# EAGLE design drive (EAGLE 5.12)
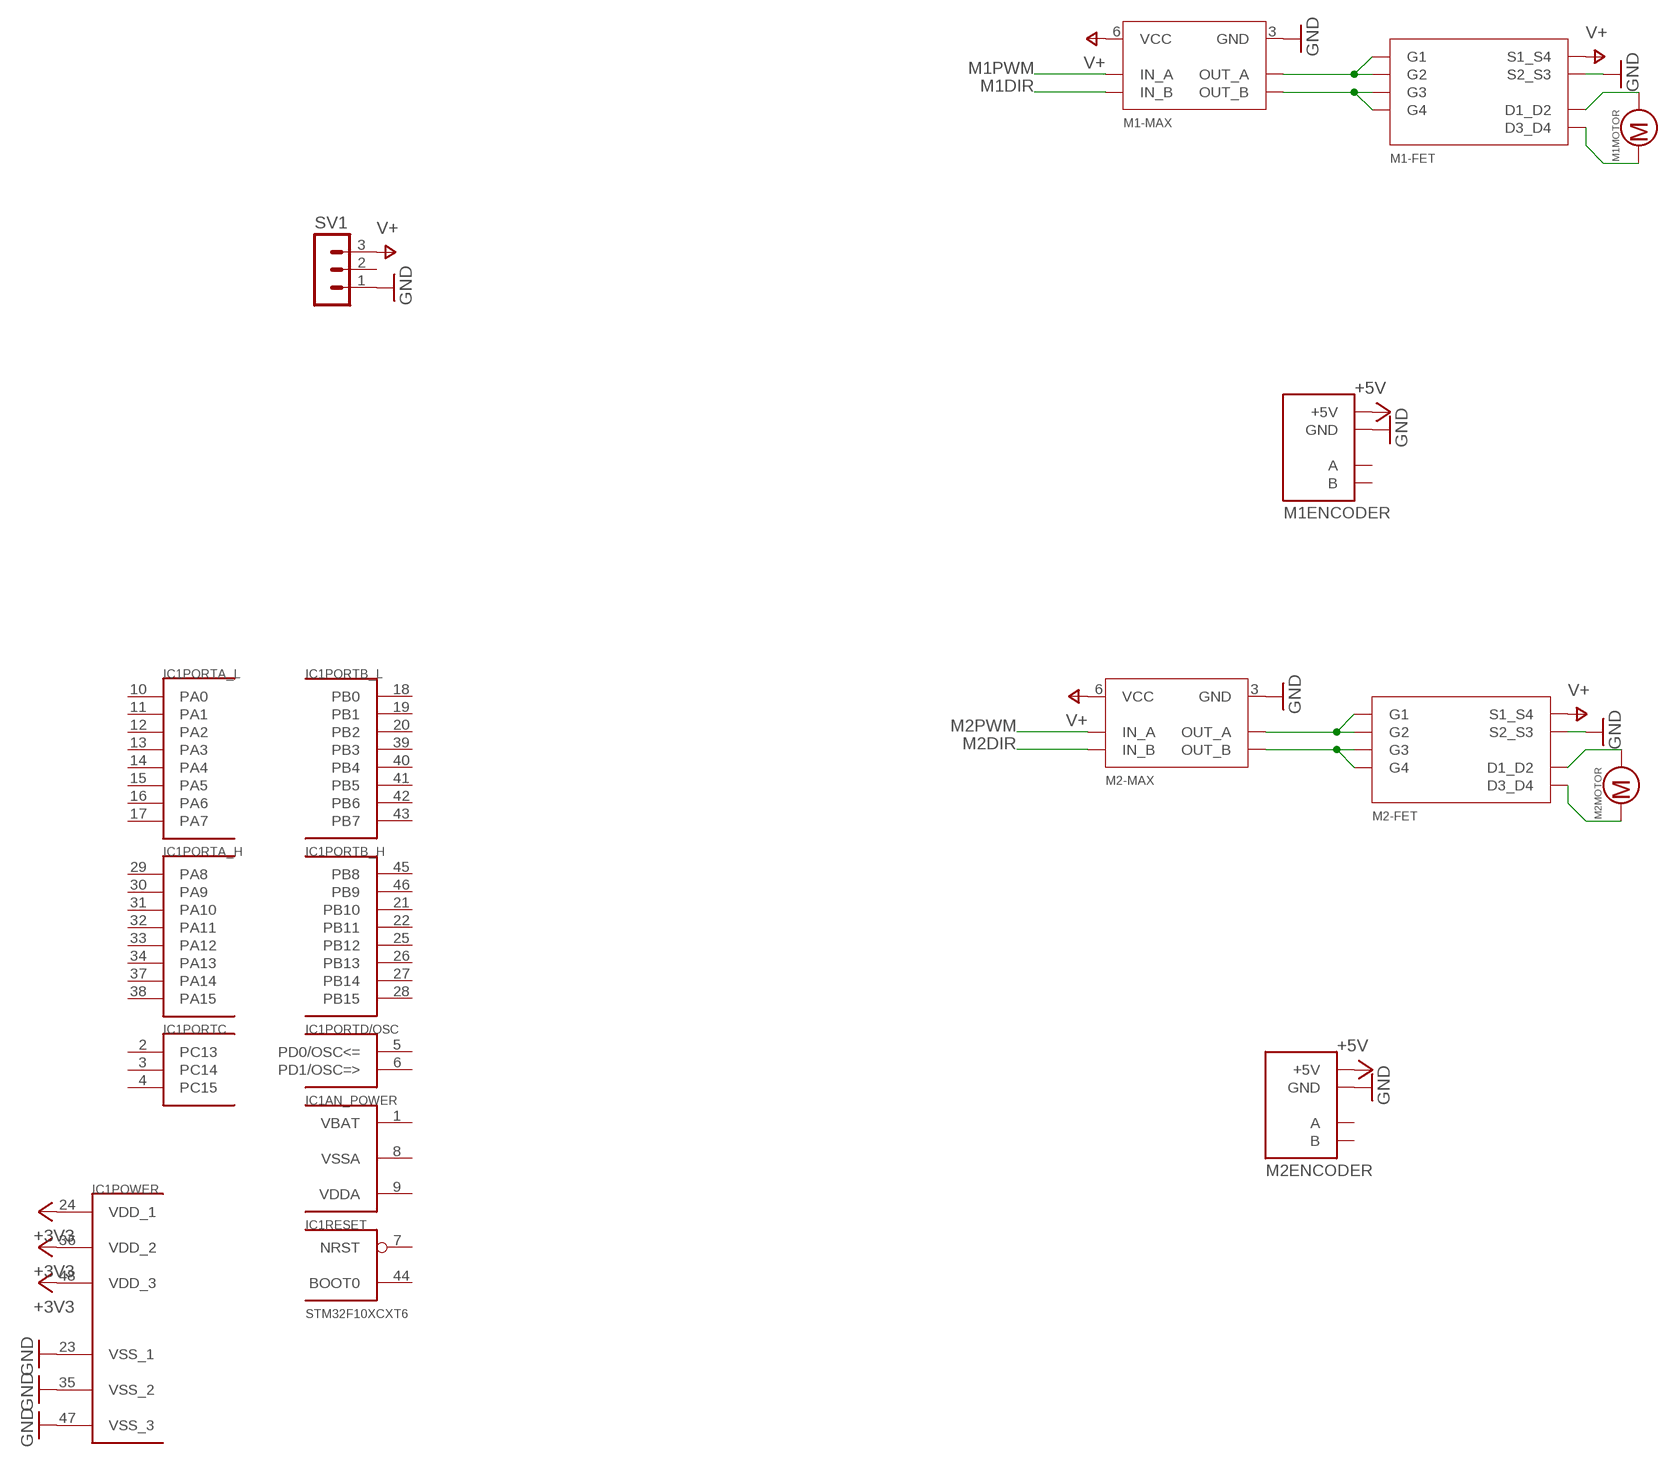
[diagram p0: schematic, sheet 1]

## Parts
IC1  STM32F10XCXT6  [TQFP48]
M1  FAULHABER-1524INLINE  [53047-06]
M1-FET  ZXMHC3A01T8  [SM8]
M1-MAX  MAX4427CSA  [SO08]
M2  FAULHABER-1524INLINE  [53047-06]
M2-FET  ZXMHC3A01T8  [SM8]
M2-MAX  MAX4427CSA  [SO08]
SV1  MA03-1  [MA03-1]

## Nets
+3V3: IC1.24(POWER:VDD_1) IC1.36(POWER:VDD_2) IC1.48(POWER:VDD_3)
+5V: M1.4(ENCODER:+5V) M2.4(ENCODER:+5V)
GND: IC1.23(POWER:VSS_1) IC1.35(POWER:VSS_2) IC1.47(POWER:VSS_3) M1-FET.2(S2_S3) M1-MAX.3(GND) M1.3(ENCODER:GND) M2-FET.2(S2_S3) M2-MAX.3(GND) M2.3(ENCODER:GND) SV1.1
M1-OUTA: M1-FET.3(G2) M1-FET.4(G1) M1-MAX.7(OUT_A)
M1-OUTB: M1-FET.1(G3) M1-FET.8(G4) M1-MAX.5(OUT_B)
M1DIR: M1-MAX.4(IN_B)
M1PWM: M1-MAX.2(IN_A)
M2DIR: M2-MAX.4(IN_B)
M2PWM: M2-MAX.2(IN_A)
N$3: M1-FET.5(D1_D2) M1.1(MOTOR:+)
N$4: M1-FET.7(D3_D4) M1.2(MOTOR:-)
N$5: M2-FET.3(G2) M2-FET.4(G1) M2-MAX.7(OUT_A)
N$6: M2-FET.1(G3) M2-FET.8(G4) M2-MAX.5(OUT_B)
N$7: M2-FET.5(D1_D2) M2.1(MOTOR:+)
N$8: M2-FET.7(D3_D4) M2.2(MOTOR:-)
V+: M1-FET.6(S1_S4) M1-MAX.6(VCC) M2-FET.6(S1_S4) M2-MAX.6(VCC) SV1.3
Unconnected: IC1.2(PORTC:PC13) IC1.3(PORTC:PC14) IC1.4(PORTC:PC15) IC1.5(PORTD/OSC:PD0/OSC<=) IC1.6(PORTD/OSC:PD1/OSC=>) IC1.7(RESET:NRST) IC1.10(PORTA_L:PA0) IC1.11(PORTA_L:PA1) IC1.12(PORTA_L:PA2) IC1.13(PORTA_L:PA3) IC1.14(PORTA_L:PA4) IC1.15(PORTA_L:PA5) IC1.16(PORTA_L:PA6) IC1.17(PORTA_L:PA7) IC1.18(PORTB_L:PB0) IC1.19(PORTB_L:PB1) IC1.20(PORTB_L:PB2) IC1.21(PORTB_H:PB10) IC1.22(PORTB_H:PB11) IC1.25(PORTB_H:PB12) IC1.26(PORTB_H:PB13) IC1.27(PORTB_H:PB14) IC1.28(PORTB_H:PB15) IC1.29(PORTA_H:PA8) IC1.30(PORTA_H:PA9) IC1.31(PORTA_H:PA10) IC1.32(PORTA_H:PA11) IC1.33(PORTA_H:PA12) IC1.34(PORTA_H:PA13) IC1.37(PORTA_H:PA14) IC1.38(PORTA_H:PA15) IC1.39(PORTB_L:PB3) IC1.40(PORTB_L:PB4) IC1.41(PORTB_L:PB5) IC1.42(PORTB_L:PB6) IC1.43(PORTB_L:PB7) IC1.44(RESET:BOOT0) IC1.45(PORTB_H:PB8) IC1.46(PORTB_H:PB9) M1.5(ENCODER:B) M1.6(ENCODER:A) M2.5(ENCODER:B) M2.6(ENCODER:A) SV1.2

## Power pins joined to a net without a drawn wire
VBAT: IC1.1(AN_POWER:VBAT)
VDDA: IC1.9(AN_POWER:VDDA)
VSSA: IC1.8(AN_POWER:VSSA)

## Library data of the parts
IC1 = stm32:STM32F10XCXT6: ST STM32F101/103 48pin LQFP
M1 M2 = FaulhaberMotors:FAULHABER-1524
M1-FET M2-FET = r3_parts:ZXMHC3A01T8: COMPLEMENTARY 30V ENHANCEMENT MODE MOSFET H-BRIDGE This new generation of trench MOSFETs from Zetex utilizes a unique structure that combines the benefits of low on-resistance with fast switching speed. This makes them ideal for high efficiency, low voltage, power management applications.
M1-MAX M2-MAX = r3_parts:MAX4427: Dual High-Speed 1.5A MOSFET Driver The MAX4426/MAX4427/MAX4428 are dual monolithic MOSFET drivers designed to translate TTL/CMOS inputs to high voltage/current outputs. The MAX4426 is a dual inverting power MOSFET driver. The MAX4427 is a dual noninverting power MOSFET driver, and the MAX4428 contains one inverting section and one noninverting section. Delay times are nearly independent of VDD (see Typical Operating Characteristics). High-current output drivers rapidly charge and discharge the gate capacitance of even the largest power MOSFETs to within millivolts of the supply rails. This produces the power MOSFETs' minimum on resistance. The MAX4426/ MAX4427/MAX4428's high speed minimizes power loss- es in switching power supplies and DC-DC converters.
SV1 = con-lstb:MA03-1: PIN HEADER; OC_FARNELL: unknown; OC_NEWARK: unknown

## Board
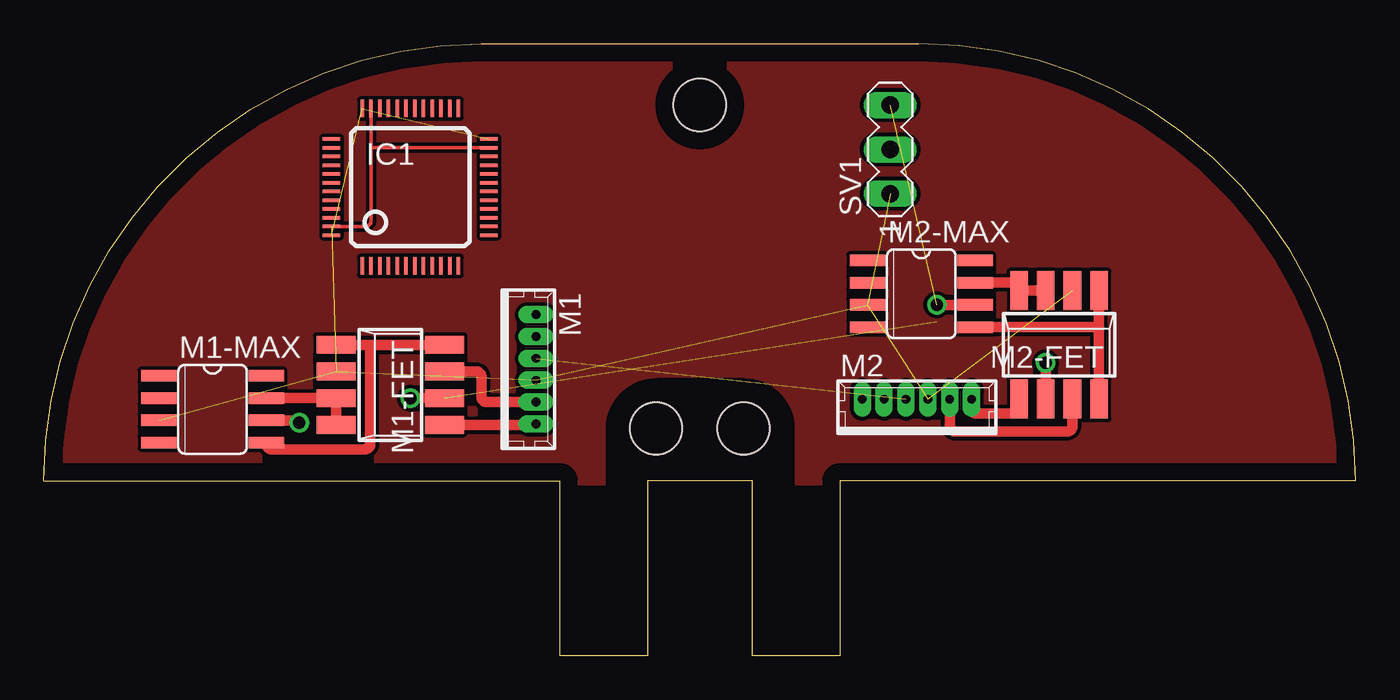
[diagram p1: board, top side]
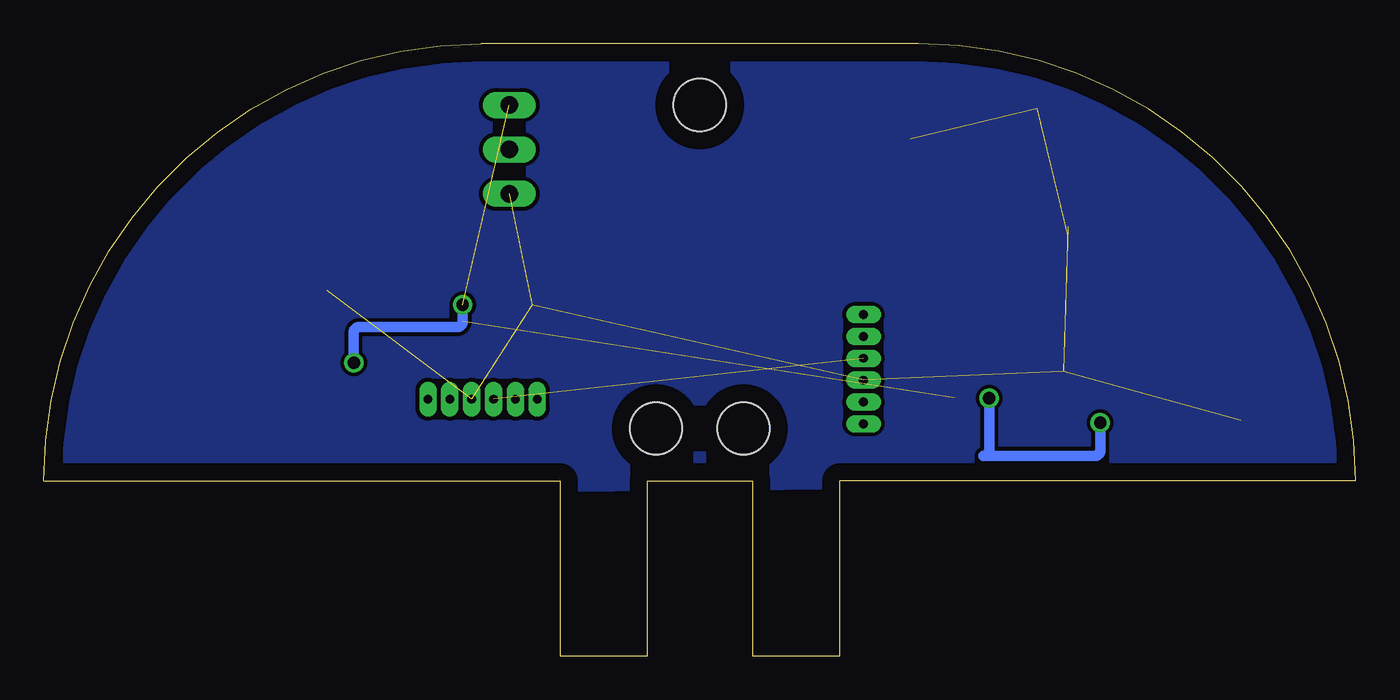
[diagram p2: board, bottom side, seen from below]

Size 75 x 35 mm. Coordinates in mm from the lower left corner, seen from the top.
Outline: 0,10 arc-90 25,35 50,35 arc-90 75,10 45.5,10 45.5,0 40.5,0 40.5,10 34.5,10 34.5,0 29.5,0 29.5,10 0,10
Copper layers (1*16): Top 0.035mm / dielectric 1.5mm / Bottom 0.035mm
Design rules "default": minimum track width 10mil, minimum drill 0.6mm, track to track 8mil, track to pad 8mil, pad to pad 8mil, via to via 8mil, smd to smd 8mil, copper to edge 40mil, drill to drill 8mil, minimum pad ring 10mil, minimum via ring 8mil, stop-mask expansion 4mil, vias tented up to drill 0mil, thermal gap 10mil
Holes 3 mm at 35,13 40,13 37.5,31.5
tRestrict: area 32.1,8.9 to 42.9,15.9

### Footprints (pad centres in the part's own frame; a part is rotated, then mirrored left to right if it is on the bottom)
TQFP48 = smd 0.2 x 1: 1 -2.75,-4.5; 2 -2.25,-4.5; 3 -1.75,-4.5; 4 -1.25,-4.5; 5 -0.75,-4.5; 6 -0.25,-4.5; 7 0.25,-4.5; 8 0.75,-4.5; 9 1.25,-4.5; 10 1.75,-4.5; 11 2.25,-4.5; 12 2.75,-4.5; 25 2.75,4.5; 26 2.25,4.5; 27 1.75,4.5; 28 1.25,4.5; 29 0.75,4.5; 30 0.25,4.5; 31 -0.25,4.5; 32 -0.75,4.5; 33 -1.25,4.5; 34 -1.75,4.5; 35 -2.25,4.5; 36 -2.75,4.5 | smd 1 x 0.2: 13 4.5,-2.75; 14 4.5,-2.25; 15 4.5,-1.75; 16 4.5,-1.25; 17 4.5,-0.75; 18 4.5,-0.25; 19 4.5,0.25; 20 4.5,0.75; 21 4.5,1.25; 22 4.5,1.75; 23 4.5,2.25; 24 4.5,2.75; 37 -4.5,2.75; 38 -4.5,2.25; 39 -4.5,1.75; 40 -4.5,1.25; 41 -4.5,0.75; 42 -4.5,0.25; 43 -4.5,-0.25; 44 -4.5,-0.75; 45 -4.5,-1.25; 46 -4.5,-1.75; 47 -4.5,-2.25; 48 -4.5,-2.75
53047-06 = drill 0.5 pad 0.698 long: 1 3.125,0.45; 2 1.875,0.45; 3 0.625,0.45; 4 -0.625,0.45; 5 -1.875,0.45; 6 -3.125,0.45
SM8 = smd 1.016 x 2.235: 1 -2.286,-3.099; 2 -0.762,-3.099; 3 0.762,-3.099; 4 2.286,-3.099; 5 2.286,3.099; 6 0.762,3.099; 7 -0.762,3.099; 8 -2.286,3.099
SO08 = smd 0.66 x 2.032: 1 -1.905,-3.073; 2 -0.635,-3.073; 3 0.635,-3.073; 4 1.905,-3.073; 5 1.905,3.073; 6 0.635,3.073; 7 -0.635,3.073; 8 -1.905,3.073
MA03-1 = drill 1.016 long: 1 -2.54,0; 2 0,0; 3 2.54,0

### Placement (x,y rotation side)
IC1  20.95,26.8 0 top
M1  27.69,16.38 270 top
M1-FET  19.81,15.49 270 top
M1-MAX  9.65,14.1 270 top
M2  49.91,14.22 0 top
M2-FET  58.04,17.78 180 top
M2-MAX  50.16,20.7 270 top
SV1  48.39,28.96 90 top

### Tracks (layer width: path | path; a pad name or v marks a point on that pad's centre or on a via)
+3V3  (2 unrouted)
+5V  (1 unrouted)
GND  (7 unrouted)
  Top 0.203: 18.7,28.96 18.7,24.86 arc-90 18.39,24.55 IC1.47 | 18.7,28.96 IC1.35 | IC1.23 18.8,29.05 arc90 18.7,28.96
M1-OUTA
  Top 0.61: M1-FET.4 M1-FET.3 M1-MAX.7
M1-OUTB
  Top 0.61: 18.67,17.78 M1-FET.1 | 18.67,17.78 M1-FET.8 | M1-MAX.5 12.72,12.13 arc90 13.04,11.81 18.35,11.81 arc90 18.67,12.13 18.67,17.78
N$1
  pour Top: 24.26,34.92 49.4,34.92 arc-90 75.06,10.67 75.06,9.91 45.47,10.03 29.34,10.03 -0.13,10.16 0,10.29 arc-90
N$2
  pour Bottom: 0.25,10.16 arc-90 24,35.05 48.39,35.05 arc-90 74.93,10.16 45.59,9.78
N$3
  Top 0.61: M1-FET.5 28.09,13.21 arc90 M1.1
N$4
  Top 0.61: M1-FET.7 24.7,16.26 arc-90 25.02,15.94 25.02,14.82 arc90 25.34,14.51 M1.2
N$5
  Top 0.61: M2-MAX.7 55.75,21.34 M2-FET.4 M2-FET.3
N$6
  Top 0.61: 60.33,18.8 M2-FET.8 | M2-MAX.5 60.33,18.8 | 60.33,18.8 M2-FET.1
N$7
  Top 0.61: M2-FET.5 55.75,14.16 arc-90 55.44,13.84 53.35,13.84 arc-90 53.04,14.16 M2.1
N$8
  Top 0.61: M2.2 51.79,13.14 arc90 52.1,12.83 58.48,12.83 arc90 58.8,13.14 M2-FET.7
V+  (via drill 0.7)  (2 unrouted)
  Top 0.61: M2-FET.6 v57.28,16.76 | v51.05,20.07 M2-MAX.6 | M1-MAX.6 14.48,13.46 arc-90 v14.61,13.34 | v20.95,14.73 M1-FET.6
  Bottom 0.61: 57.28,16.64 v57.28,16.76 57.28,18.48 arc90 56.96,18.8 51.37,18.8 arc-90 51.05,19.11 v51.05,20.07 51.18,20.07 | 14.61,13.46 v14.61,13.34 14.61,11.75 arc90 14.92,11.43 21.27,11.43 arc-90 20.95,11.75 v20.95,14.73 21.08,14.73